# Altium schematic sheet USB.SchDoc: Titel
size A3; DesignedDate: 01-01-12; CompanyName: DCI Electronics bv; DrawnBy: KRS; Organization: DCI Electronics; Address1: Nijverheidsstraat 14; Address2: 4458 AV Eindewege; Address3: Phone: +31 (0)113 344880; DocumentNumber: 3; Revision: 1; SheetNumber: 3; SheetTotal: 14; PageSetup: Record=PageOptions|CenterHorizontal=True|CenterVertical=True|PrintScale=1.00|XCorrection=1.00|YCorrection=1.00|PrintKind=1|BorderSize=5000000|LeftOffset=0|BottomOffset=0|Orientation=2|PaperLength=1000|PaperWidth=1000|Scale=100|PaperSource=7|PrintQuality=-4|MediaType=1|DitherType=10|PaperKind=ISO_A4_(210.00_x_297.00_MM)|PrintScaleMode=1; SubTitle: SubTitel
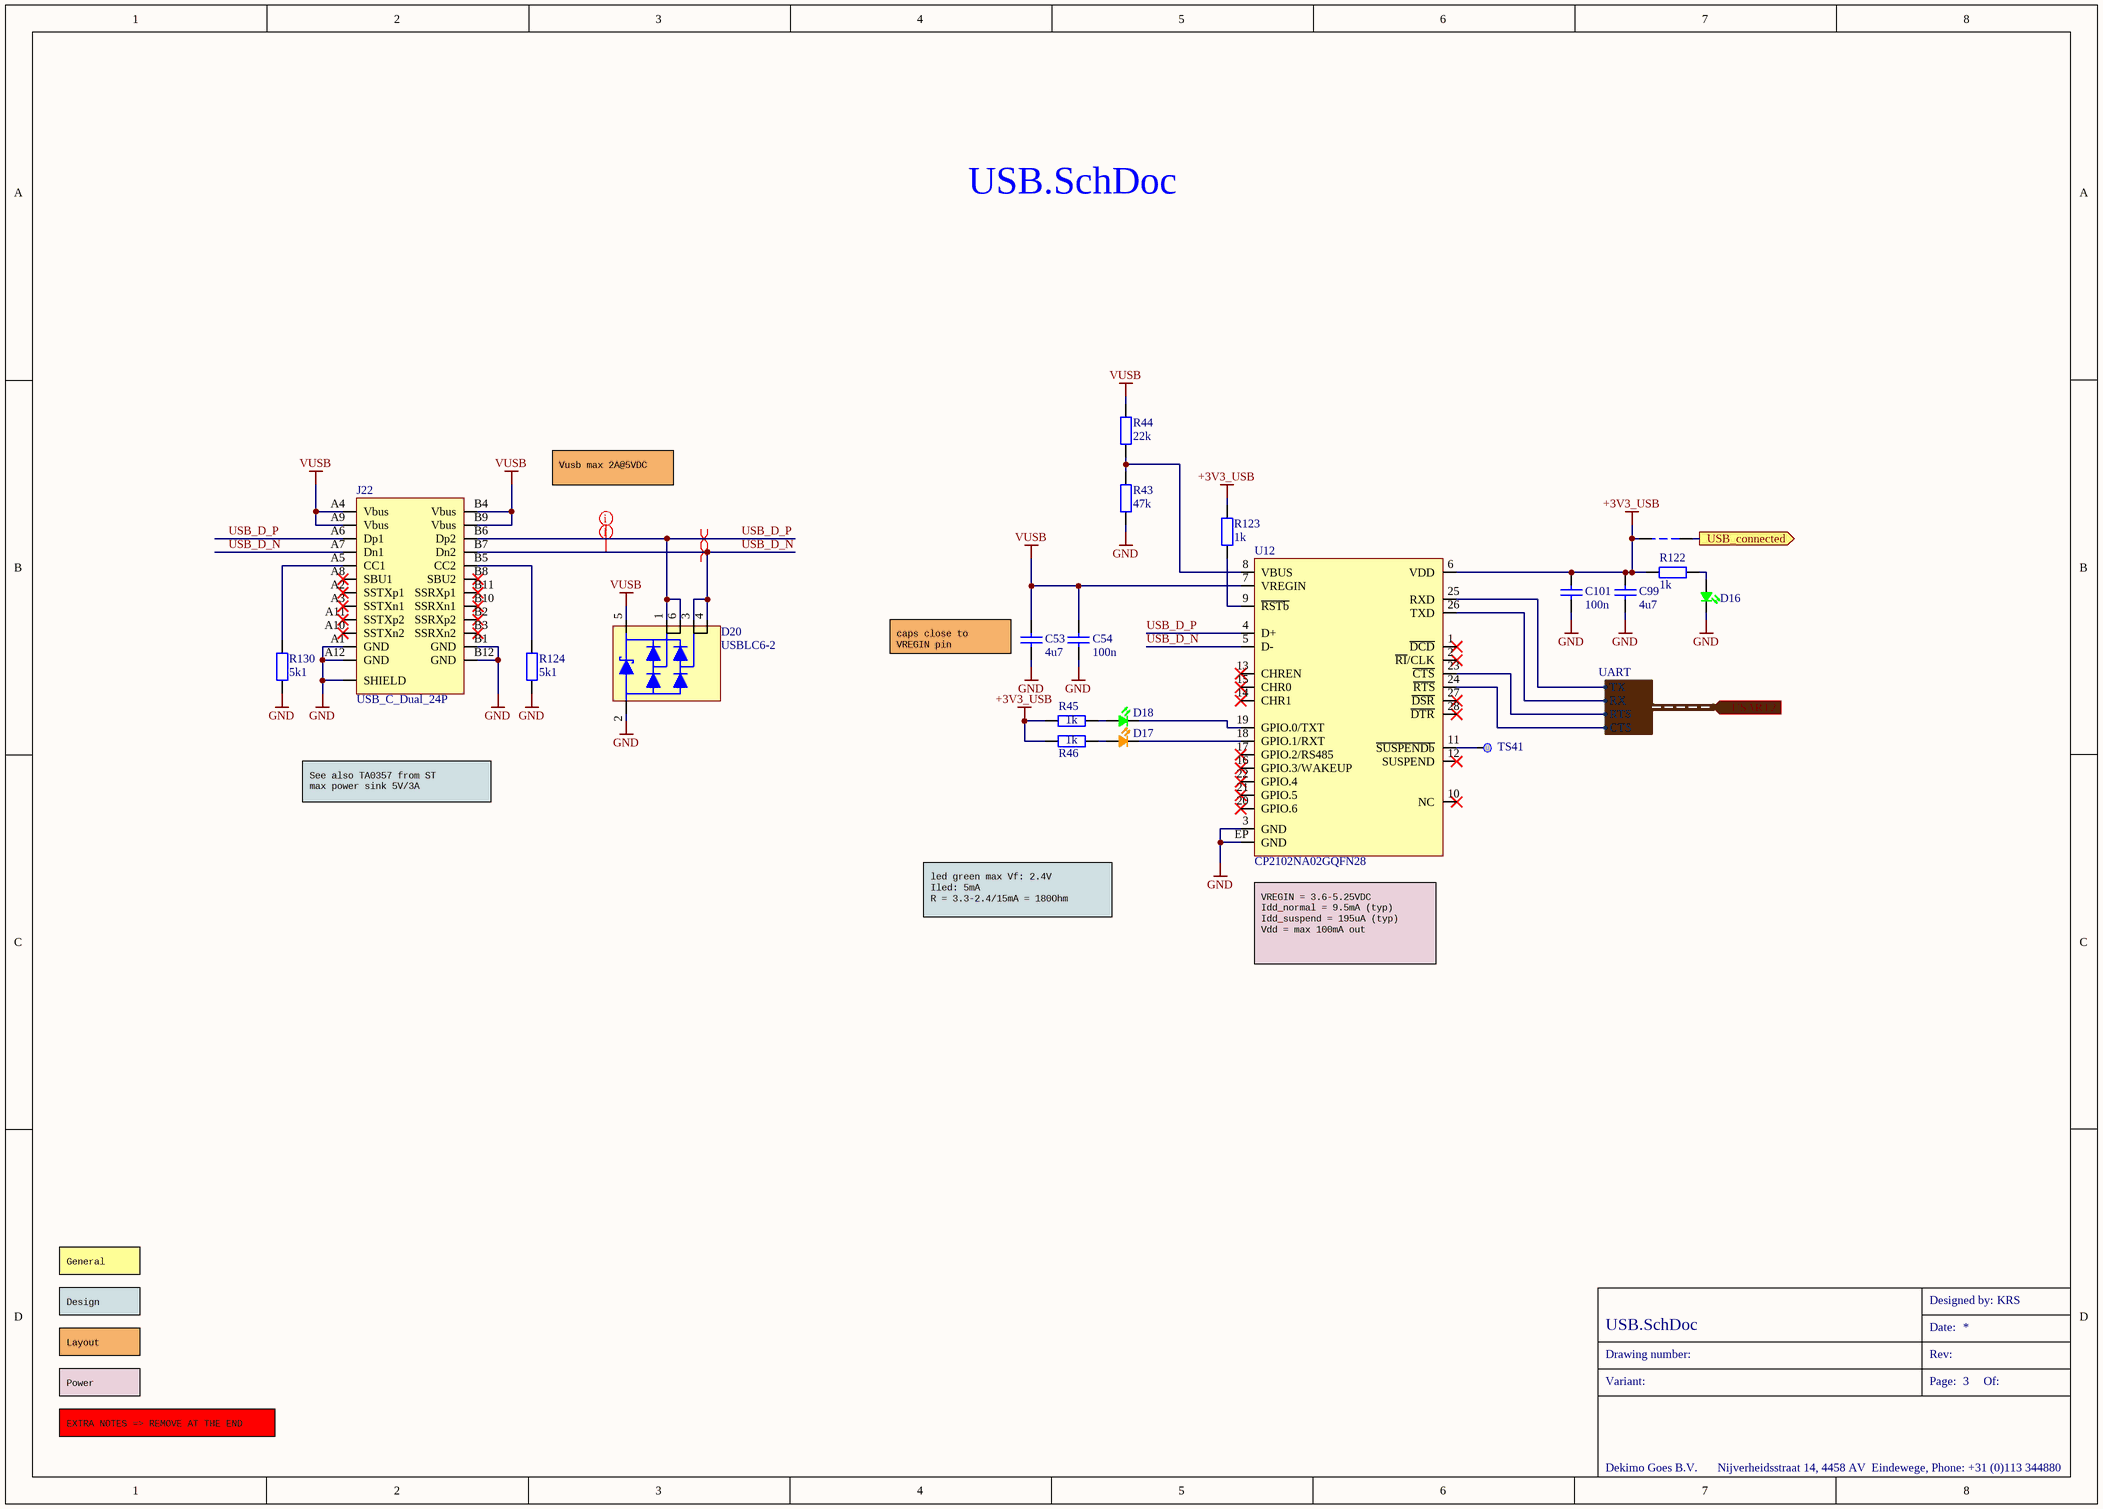
[diagram p0: USB.SchDoc]

## Parts
C53  4u7  [CAPC3216X13N]
C54  100n  [CAPC1608X09N]
C99  4u7  [CAPC3216X13N]
C101  100n  [CAPC1608X09N]
D16  (no value)  [LED_0603_ANODE]
D17  (no value)  [LED_0603]
D18  (no value)  [LED_0603_ANODE]
D20  USBLC6-2  [SOT95P280X110-6N]
J22  USB_C_Dual_24P  [CON-009G000-024]
NT1  NET_TIE2  [NET_TIE_02MM]  (value not drawn)  (net tie, no BOM)
R43  47k  [RESC1608X13N]
R44  22k  [RESC1608X13N]
R45  1k  [RESC1608X13N]
R46  1k  [RESC1608X13N]
R122  1k  [RESC1608X13N]
R123  1k  [RESC1608X13N]
R124  5k1  [RESC1608X13N]
R130  5k1  [RESC1608X13N]
TS41  TESTPAD  [TESTPAD 2MM]  (value not drawn)  (no BOM)
U12  CP2102NA02GQFN28  [QFN28_5x5mmP0.5]

## Ports
USART2 (in, harness UART), USB_connected (out)

## Harnesses
UART: CTS, RTS, RX, TX

## Nets
+3V3_USB: C99.2 C101.2 NT1.2 R45.2 R46.2 R122.1 R123.2 U12.6(VDD)
GND: C53.1 C54.1 C99.1 C101.1 D16.C D20.2(A) J22.A1(GND) J22.A12(GND) J22.B1(GND) J22.B12(GND) J22.S(SHIELD) R43.1 R124.1 R130.1 U12.3(GND) U12.EP(GND)
VUSB: C53.2 C54.2 D20.5(A) J22.A4(Vbus) J22.A9(Vbus) J22.B4(Vbus) J22.B9(Vbus) R44.2 U12.7(VREGIN)
USB_connected: NT1.1 ; port USB_connected
USB_D_N: D20.3(A) D20.4(A) J22.A7(Dn1) J22.B7(Dn2) U12.5(D-)
USB_D_P: D20.1(A) D20.6(A) J22.A6(Dp1) J22.B6(Dp2) U12.4(D+)
NetD16_A: D16.A R122.2
NetD17_A: D17.A R46.1
NetD17_C: D17.C U12.18(GPIO.1/RXT)
NetD18_A: D18.A R45.1
NetD18_C: D18.C U12.19(GPIO.0/TXT)
NetJ22_A5: J22.A5(CC1) R130.2
NetJ22_B5: J22.B5(CC2) R124.2
NetR43_2: R43.2 R44.1 U12.8(VBUS)
NetR123_1: R123.1 U12.9(~{RSTb})
NetTS41_1: TS41.1(TP) U12.11(~{SUSPENDb})
NetU12_23: U12.23(~{CTS}) ; port USART2.RTS
NetU12_24: U12.24(~{RTS}) ; port USART2.CTS
NetU12_25: U12.25(RXD) ; port USART2.TX
NetU12_26: U12.26(TXD) ; port USART2.RX

Not connected (* = marked no-connect by the designer): J22 A2(SSTXp1)* A3(SSTXn1)* A8(SBU1)* A10(SSTXn2)* A11(SSTXp2)* B2(SSRXp2)* B3(SSRXn2)* B8(SBU2)* B10(SSRXn1)* B11(SSRXp1)*; U12 1(~{DCD})* 2(~{RI}/CLK)* 10(NC)* 12(SUSPEND)* 13(CHREN)* 14(CHR1)* 15(CHR0)* 16(GPIO.3/WAKEUP)* 17(GPIO.2/RS485)* 20(GPIO.6)* 21(GPIO.5)* 22(GPIO.4)* 27(~{DSR})* 28(~{DTR})*

## Layout directives
net class 90R: USB_D_N, USB_D_P
differential pair; differential pair class USB: USB_D_N, USB_D_P

## Notes on the sheet
- Vusb max 2A@5VDC
- (near C53) caps close to VREGIN pin
- See also TA0357 from ST
  max power sink 5V/3A
- led green max Vf: 2.4V
  Iled: 5mA
  R = 3.3-2.4/15mA = 180Ohm
- (near U12) VREGIN = 3.6-5.25VDC
  Idd_normal = 9.5mA (typ)
  Idd_suspend = 195uA (typ)
  Vdd = max 100mA out
- Design
- General
- Layout
- Power
- EXTRA NOTES => REMOVE AT THE END
- Designed by:
- Drawing number:
- Variant:
- Date:
- Page:
- Rev:
- Of:
- Dekimo Goes B.V.
- Nijverheidsstraat 14, 4458 AV  Eindewege, Phone: +31 (0)113 344880

## Library data of the parts
C53 C99 = CKE 4U7V50/10: 4.7uF 50V 20% X5R; EngPartGrpMainCode: CAP; ManufactpartCode: C1206C475M5PAC-KEM; Type: Capacitor ceramic SMD; Preferred: False; SMD_Flag: True; PartCode: CKE 4U7V50/10
C54 C101 = CKE 100N/60: 100nF 50V 10% X7R; EngPartGrpMainCode: CAP; ManufactpartCode: 2238 586 15649-PHI; Type: Capacitor ceramic SMD; Preferred: False; SMD_Flag: True; PartCode: CKE 100N/60
D16 D18 = LED SMDG/16: Led Groen 0603; EngPartGrpMainCode: OPTO; ManufactpartCode: 150060VS75003-WE; Type: LED SMD; Preferred: False; SMD_Flag: True; PartCode: LED SMDG/16
D17 = LED SMDO/3: Led Orange 0603; EngPartGrpMainCode: OPTO; ManufactpartCode: 150060AS75000-WE; Type: LED SMD; Preferred: False; SMD_Flag: True; PartCode: LED SMDO/3
D20 = DIO USBLC6: USB2 protector, 15kV/8kV; EngPartGrpMainCode: DIO; ManufactpartCode: USBLC6-2SC6-STM; Type: TVS diode array SMD; Preferred: False; SMD_Flag: True; PartCode: DIO USBLC6
J22 = CON USB-C/4: USB C vertical entry; EngPartGrpMainCode: CONN; ManufactpartCode: USB-C31-S-VT-CS4-BK-PP-T/R-ADT; Preferred: False; SMD_Flag: True; PartCode: CON USB-C/4; Type: Connector USB SMD
NT1 = NET_TIE: Net-Tie for 2 Nets; Value: DNP
R43 = R 47K/60: 47k 100mW 1%; EngPartGrpMainCode: RES; ManufactpartCode: RC0603FR-0747KL-YAG; Preferred: False; SMD_Flag: True; PartCode: R 47K/60; Type: Resistor metalfilm SMD
R44 = R 22K/60: 22K 0.1W 1%; EngPartGrpMainCode: RES; ManufactpartCode: RC0603FR-0722KL-YAG; Preferred: False; SMD_Flag: True; PartCode: R 22K/60; Type: Resistor metalfilm SMD
R45 R46 R122 R123 = R 1K/60: 1K, 100mW, 1%; PartCode: R 1K/60; EngPartGrpMainCode: RES; ManufactpartCode: RC0603FR-071KL-YAG; Preferred: True; Type: Resistor metalfilm SMD; SMD_Flag: True
R124 R130 = R 5K1/61: 5k1 0.1W 5%; EngPartGrpMainCode: RES; ManufactpartCode: RC0603JR-075K1L-YAG; Preferred: False; SMD_Flag: True; PartCode: R 5K1/61; Type: Resistor metalfilm SMD
TS41 = TESTPAD-2.0: 0.5mm Testpad SMD; PartCode: TESTPAD-2.0
U12 = IC CP2102N-A02: USB to UART Bridge; EngPartGrpMainCode: IC; ManufactpartCode: CP2102N-A02-GQFN28-SIL; Preferred: False; SMD_Flag: True; PartCode: IC CP2102N-A02; Type: IC interface SMD